# EAGLE schematic MainCircuit (EAGLE 6.3)
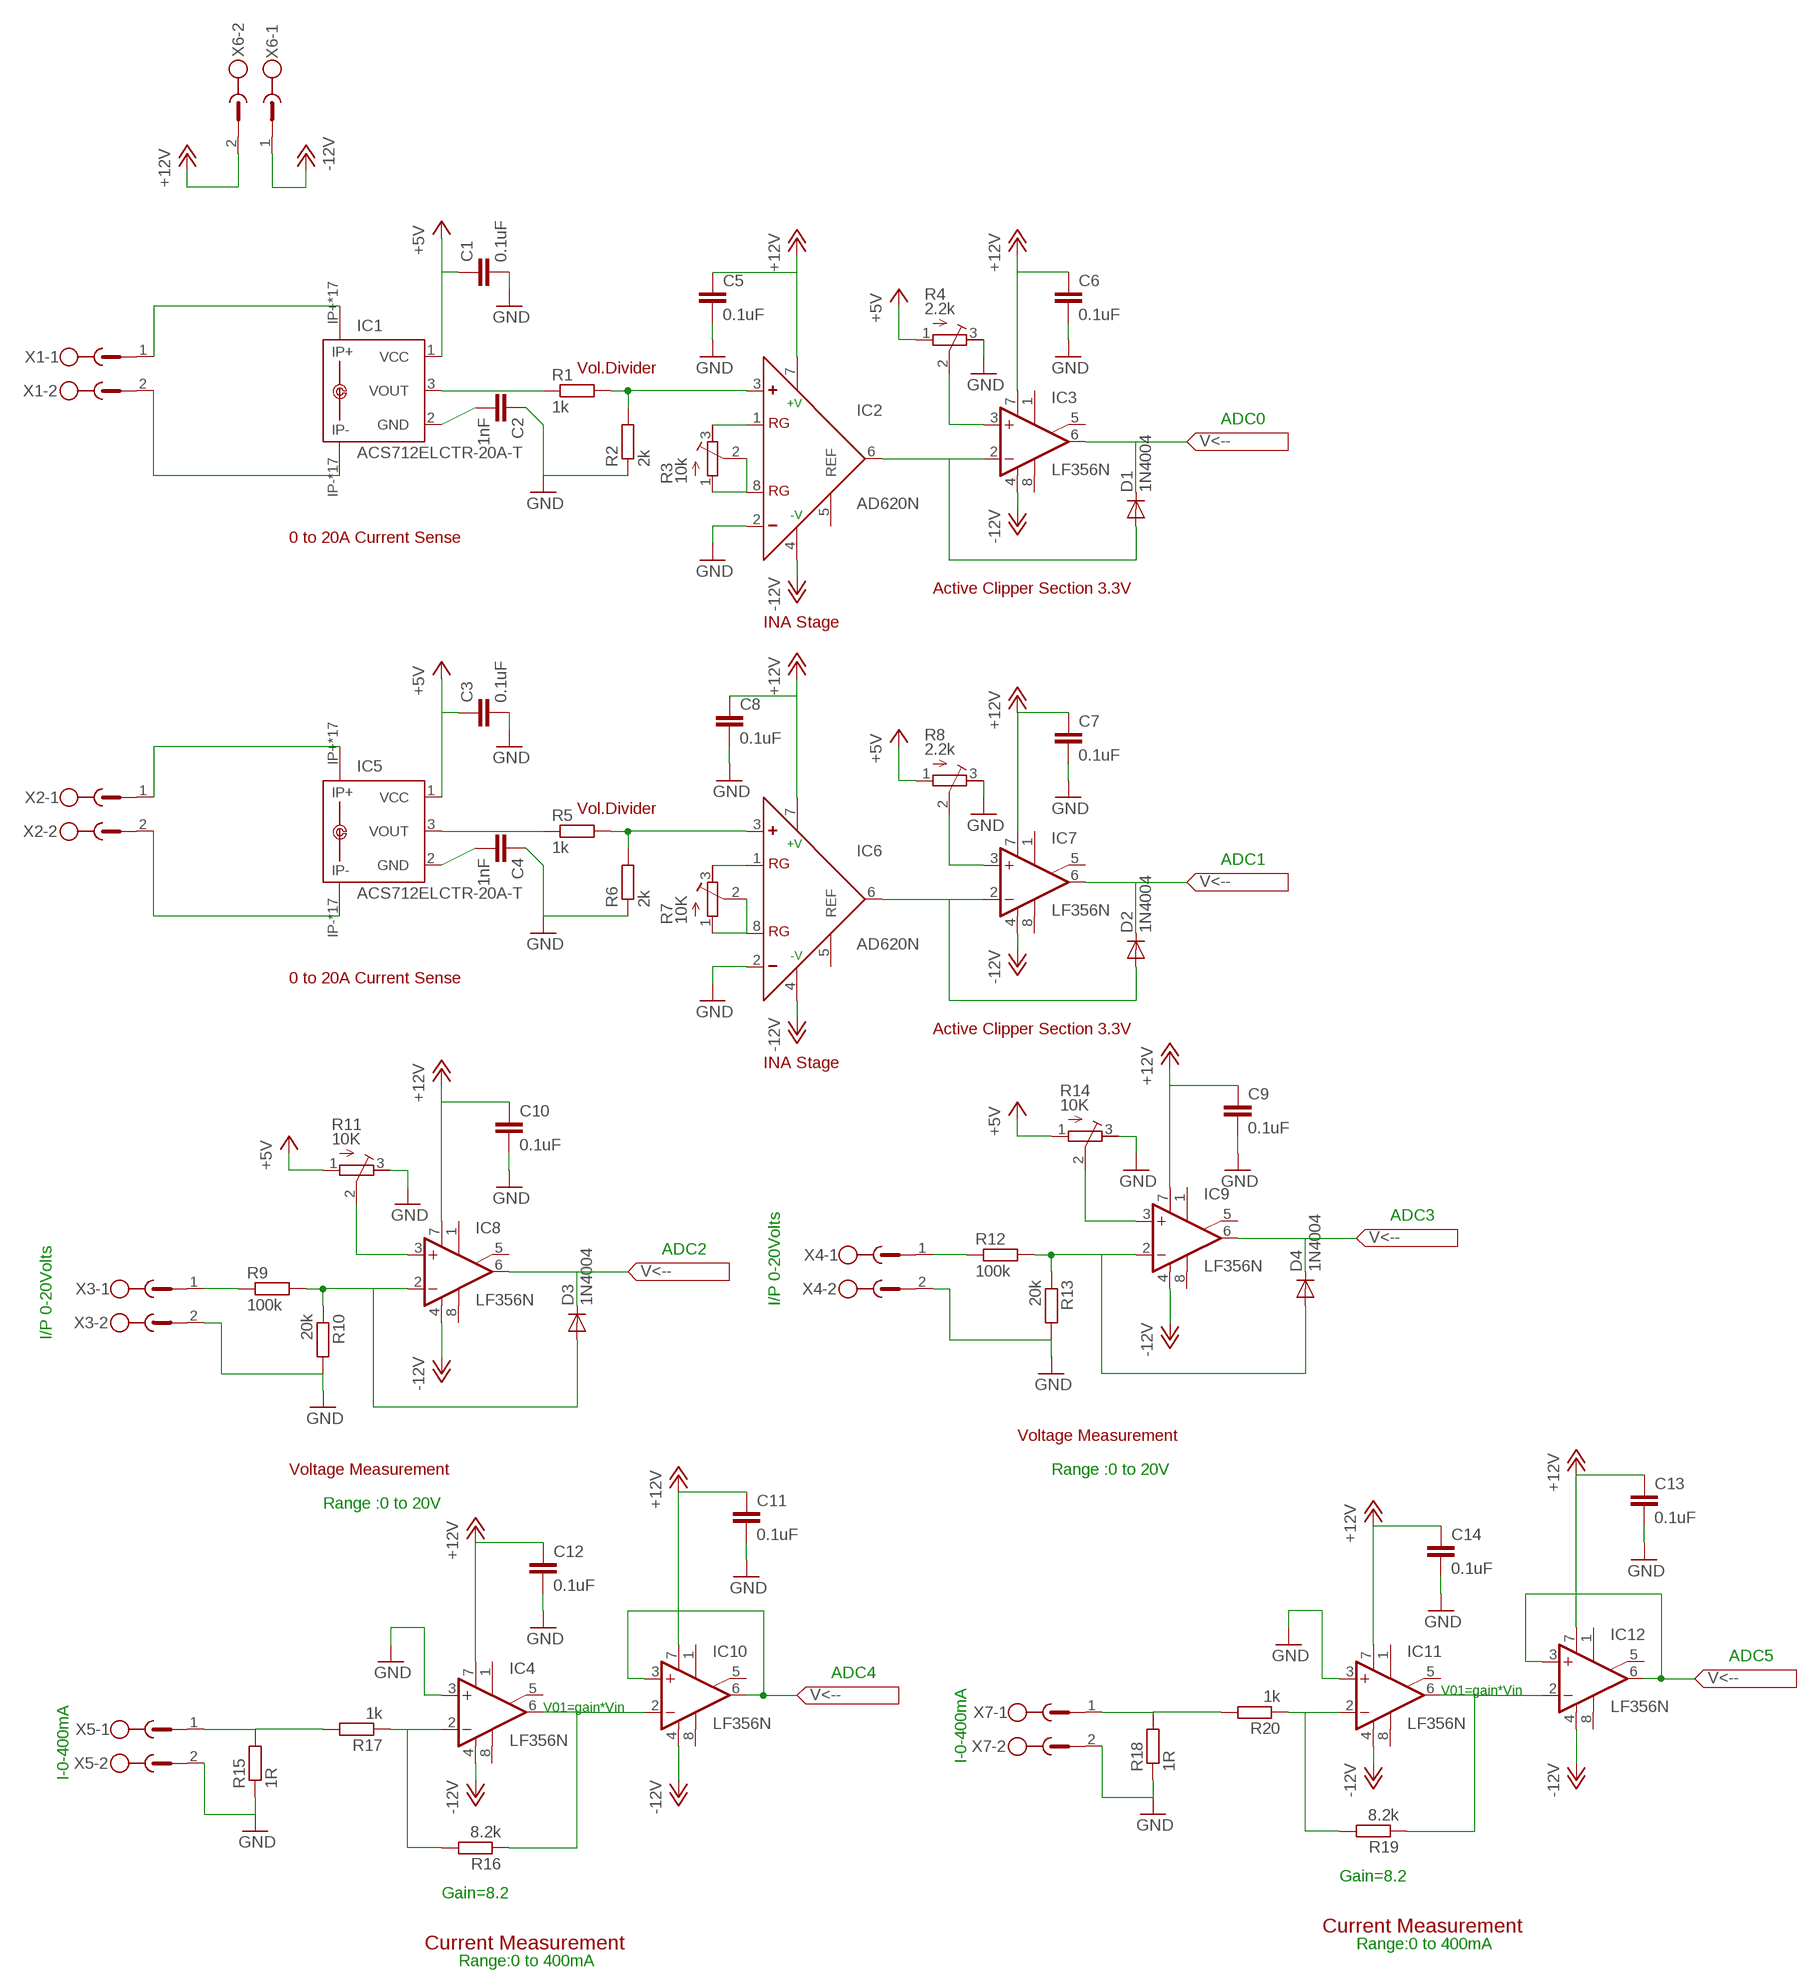
[diagram p0: schematic, sheet 1]

## Parts
C1  0.1uF  C-EU025-024X044  [C025-024X044]
C2  1nF  C-EU025-024X044  [C025-024X044]
C3  0.1uF  C-EU025-024X044  [C025-024X044]
C4  1nF  C-EU025-024X044  [C025-024X044]
C5  0.1uF  C-EU025-024X044  [C025-024X044]
C6  0.1uF  C-EU025-024X044  [C025-024X044]
C7  0.1uF  C-EU025-024X044  [C025-024X044]
C8  0.1uF  C-EU025-024X044  [C025-024X044]
C9  0.1uF  C-EU025-024X044  [C025-024X044]
C10  0.1uF  C-EU025-024X044  [C025-024X044]
C11  0.1uF  C-EU025-024X044  [C025-024X044]
C12  0.1uF  C-EU025-024X044  [C025-024X044]
C13  0.1uF  C-EU025-024X044  [C025-024X044]
C14  0.1uF  C-EU025-024X044  [C025-024X044]
D1  1N4004  [DO41-10]
D2  1N4004  [DO41-10]
D3  1N4004  [DO41-10]
D4  1N4004  [DO41-10]
IC1  ACS712ELCTR-20A-T  ACS758ECB-200B-PFF-T  [CB-PFF]
IC2  AD620N  [DIL08]
IC3  LF356N  [DIL08]
IC4  LF356N  [DIL08]
IC5  ACS712ELCTR-20A-T  ACS758ECB-200B-PFF-T  [CB-PFF]
IC6  AD620N  [DIL08]
IC7  LF356N  [DIL08]
IC8  LF356N  [DIL08]
IC9  LF356N  [DIL08]
IC10  LF356N  [DIL08]
IC11  LF356N  [DIL08]
IC12  LF356N  [DIL08]
R1  1k  R-EU_0204/7  [0204/7]
R2  2k  R-EU_0204/7  [0204/7]
R3  10k  R-TRIMM64W  [RTRIM64W]
R4  2.2k  R-TRIMM64W  [RTRIM64W]
R5  1k  R-EU_0204/7  [0204/7]
R6  2k  R-EU_0204/7  [0204/7]
R7  10K  R-TRIMM64W  [RTRIM64W]
R8  2.2k  R-TRIMM64W  [RTRIM64W]
R9  100k  R-EU_0207/5V  [0207/5V]
R10  20k  R-EU_0207/5V  [0207/5V]
R11  10K  R-TRIMM64W  [RTRIM64W]
R12  100k  R-EU_0207/5V  [0207/5V]
R13  20k  R-EU_0207/5V  [0207/5V]
R14  10K  R-TRIMM64W  [RTRIM64W]
R15  1R  R-EU_0204/7  [0204/7]
R16  8.2k  R-EU_0204/7  [0204/7]
R17  1k  R-EU_0204/7  [0204/7]
R18  1R  R-EU_0204/7  [0204/7]
R19  8.2k  R-EU_0204/7  [0204/7]
R20  1k  R-EU_0204/7  [0204/7]
X1  MSTBV2  [MSTBV2]
X2  MSTBV2  [MSTBV2]
X3  MSTBV2  [MSTBV2]
X4  MSTBV2  [MSTBV2]
X5  MSTBV2  [MSTBV2]
X6  MSTBV2  [MSTBV2]
X7  MSTBV2  [MSTBV2]

## Nets
+5V: C1.1 C3.1 IC1.1(VCC) IC5.1(VCC) R4.1(A) R8.1(A) R11.1(A) R14.1(A)
+12V: C5.1 C6.1 C7.1 C8.1 C9.1 C10.1 C11.1 C12.1 C13.1 C14.1 IC2.7(+V) IC3.7(V+) IC4.7(V+) IC6.7(+V) IC7.7(V+) IC8.7(V+) IC9.7(V+) IC10.7(V+) IC11.7(V+) IC12.7(V+) X6.2
-12V: IC2.4(-V) IC3.4(V-) IC4.4(V-) IC6.4(-V) IC7.4(V-) IC8.4(V-) IC9.4(V-) IC10.4(V-) IC11.4(V-) IC12.4(V-) X6.1
GND: C1.2 C2.1 C3.2 C4.1 C5.2 C6.2 C7.2 C8.2 C9.2 C10.2 C11.2 C12.2 C13.2 C14.2 IC2.2(-) IC4.3(+IN) IC6.2(-) IC11.3(+IN) R2.1 R4.3(E) R6.1 R8.3(E) R10.2 R11.3(E) R13.2 R14.3(E) R15.1 R18.1 X3.2 X4.2 X5.2 X7.2
N$1: C2.2 IC1.2(GND)
N$2: IC1.3(VOUT) R1.1
N$3: IC2.3(+) R1.2 R2.2
N$4: IC1.IP+ IC1.IP+@2(IP+) IC1.IP+@3(IP+) IC1.IP+@4(IP+) IC1.IP+@5(IP+) IC1.IP+@6(IP+) IC1.IP+@7(IP+) IC1.IP+@8(IP+) IC1.IP+@9(IP+) IC1.IP+@10(IP+) IC1.IP+@11(IP+) IC1.IP+@12(IP+) IC1.IP+@13(IP+) IC1.IP+@14(IP+) IC1.IP+@15(IP+) IC1.IP+@16(IP+) IC1.IP+@17(IP+) X1.1
N$5: IC1.IP- IC1.IP-@2(IP-) IC1.IP-@3(IP-) IC1.IP-@4(IP-) IC1.IP-@5(IP-) IC1.IP-@6(IP-) IC1.IP-@7(IP-) IC1.IP-@8(IP-) IC1.IP-@9(IP-) IC1.IP-@10(IP-) IC1.IP-@11(IP-) IC1.IP-@12(IP-) IC1.IP-@13(IP-) IC1.IP-@14(IP-) IC1.IP-@15(IP-) IC1.IP-@16(IP-) IC1.IP-@17(IP-) X1.2
N$6: IC2.8(RG) R3.1(A) R3.2(S)
N$7: IC2.1(RG) R3.3(E)
N$8: D1.A IC2.6(OUT) IC3.2(-IN)
N$9: IC3.3(+IN) R4.2(S)
N$10: IC8.3(+IN) R11.2(S)
N$11: IC11.2(-IN) R19.2 R20.1
N$12: IC11.6(OUT) IC12.2(-IN) R19.1
N$13: D1.C IC3.6(OUT)
N$14: C4.2 IC5.2(GND)
N$15: IC5.3(VOUT) R5.1
N$16: IC6.3(+) R5.2 R6.2
N$17: IC5.IP+ IC5.IP+@2(IP+) IC5.IP+@3(IP+) IC5.IP+@4(IP+) IC5.IP+@5(IP+) IC5.IP+@6(IP+) IC5.IP+@7(IP+) IC5.IP+@8(IP+) IC5.IP+@9(IP+) IC5.IP+@10(IP+) IC5.IP+@11(IP+) IC5.IP+@12(IP+) IC5.IP+@13(IP+) IC5.IP+@14(IP+) IC5.IP+@15(IP+) IC5.IP+@16(IP+) IC5.IP+@17(IP+) X2.1
N$18: IC5.IP- IC5.IP-@2(IP-) IC5.IP-@3(IP-) IC5.IP-@4(IP-) IC5.IP-@5(IP-) IC5.IP-@6(IP-) IC5.IP-@7(IP-) IC5.IP-@8(IP-) IC5.IP-@9(IP-) IC5.IP-@10(IP-) IC5.IP-@11(IP-) IC5.IP-@12(IP-) IC5.IP-@13(IP-) IC5.IP-@14(IP-) IC5.IP-@15(IP-) IC5.IP-@16(IP-) IC5.IP-@17(IP-) X2.2
N$19: IC6.8(RG) R7.1(A) R7.2(S)
N$20: IC6.1(RG) R7.3(E)
N$21: D2.A IC6.6(OUT) IC7.2(-IN)
N$22: IC7.3(+IN) R8.2(S)
N$23: R18.2 R20.2 X7.1
N$24: IC12.3(+IN) IC12.6(OUT)
N$25: D2.C IC7.6(OUT)
N$26: D3.A IC8.2(-IN) R9.2 R10.1
N$27: R9.1 X3.1
N$28: R15.2 R17.2 X5.1
N$30: D3.C IC8.6(OUT)
N$33: IC10.3(+IN) IC10.6(OUT)
N$35: D4.A IC9.2(-IN) R12.2 R13.1
N$36: R12.1 X4.1
N$37: IC9.3(+IN) R14.2(S)
N$38: D4.C IC9.6(OUT)
N$41: IC4.2(-IN) R16.2 R17.1
N$42: IC4.6(OUT) IC10.2(-IN) R16.1
Unconnected: IC2.5(REF) IC3.1(ON1) IC3.5(ON2) IC3.8(OPT) IC4.1(ON1) IC4.5(ON2) IC4.8(OPT) IC6.5(REF) IC7.1(ON1) IC7.5(ON2) IC7.8(OPT) IC8.1(ON1) IC8.5(ON2) IC8.8(OPT) IC9.1(ON1) IC9.5(ON2) IC9.8(OPT) IC10.1(ON1) IC10.5(ON2) IC10.8(OPT) IC11.1(ON1) IC11.5(ON2) IC11.8(OPT) IC12.1(ON1) IC12.5(ON2) IC12.8(OPT)

## Notes on the sheet
- Vol.Divider
- ADC0
- 0 to 20A Current Sense
- Active Clipper Section 3.3V
- INA Stage
- Vol.Divider
- ADC1
- 0 to 20A Current Sense
- Active Clipper Section 3.3V
- INA Stage
- ADC3
- ADC2
- I/P 0-20Volts
- I/P 0-20Volts
- Voltage Measurement
- Voltage Measurement | Range :0 to 20V
- Range :0 to 20V
- ADC5
- ADC4
- V01=gain*Vin
- V01=gain*Vin
- I-0-400mA
- I-0-400mA
- Gain=8.2
- Gain=8.2
- Current Measurement
- Current Measurement | Range:0 to 400mA
- Range:0 to 400mA

## Library data of the parts
C1-C14 = rcl:C-EU: CAPACITOR, European symbol
D1-D4 = diode:1N4004: DIODE general purpose rectifier, 1 A
IC1 IC5 = allegro:ACS758*: Thermally Enhanced, Fully Integrated, Hall Effect-Based Linear Current Sensor with 100 micro Ohm Current Conductor display layer 49 Reference in BRD and place VIAs on circles Source: http://www.allegromicro.com/en/Products/Part_Numbers/0758/0758.pdf; MPN: ACS758ECB-200B-PFF-T; OC_FARNELL: 1718993; OC_NEWARK: 04R7127
IC2 IC6 = analog-devices:AD620: Low Cost, Low Power, Instrumentation Amplifier Source: http://www.analog.com/UploadedFiles/Data_Sheets/37793330023930AD620_e.pdf; MF: ALTERA CORPORATION; MPN: AD620AN; OC_FARNELL: 1523782; OC_NEWARK: 05F7108
IC3 IC4 IC7-IC12 = linear:LF356: OP AMP
R1 R2 R5 R6 R9 R10 R12 R13 R15-R20 = rcl:R-EU_: RESISTOR, European symbol
R3 R4 R7 R8 R11 R14 = rcl:R-TRIMM: Trimm resistor
X1-X7 = con-phoenix-500:MSTBV2: PHOENIX; OC_FARNELL: unknown; OC_NEWARK: unknown